# EAGLE design D5S (EAGLE 6.2)

## Sheet 1 of 2
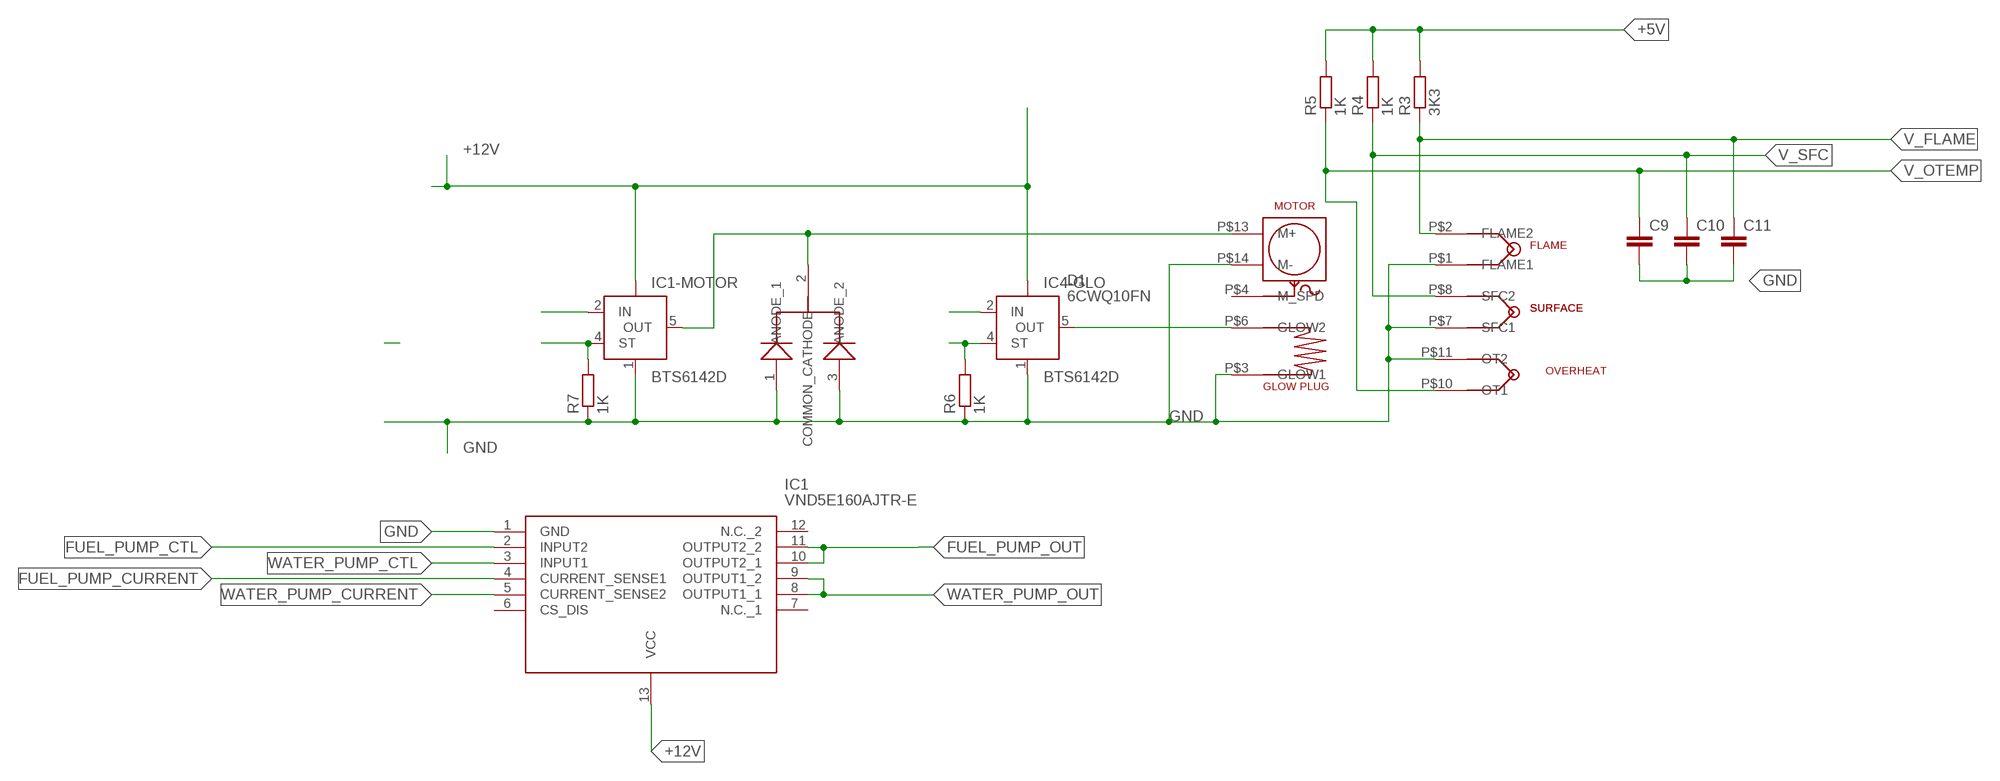
[diagram p0: schematic, sheet 1]

### Parts
C9  C-EUC0603  [C0603]
C10  C-EUC0603  [C0603]
C11  C-EUC0603  [C0603]
D1  6CWQ10FN  [6CWQ10FN]
IC1  VND5E160AJTR-E  [SOP80P600X162-13N]
IC1-MOTOR  BTS6142D  BTS428L2  [TO252-5-11]
IC4-GLO  BTS6142D  BTS428L2  [TO252-5-11]
R3  3K3  R-EU_R0603  [R0603]
R4  1K  R-EU_R0603  [R0603]
R5  1K  R-EU_R0603  [R0603]
R6  1K  R-EU_R0603  [R0603]
R7  1K  R-EU_R0603  [R0603]
U$1  D5S  [PCB]

### Nets
+5V: R3.2 R4.2 R5.2 ; also sheet 2
+12V [SPACED]: IC1-MOTOR.TAB(VBB) IC1.13(VCC) IC4-GLO.TAB(VBB)
FAN_CTL: IC1-MOTOR.2(IN) ; also sheet 2
FAN_SENSE: IC1-MOTOR.4(ST) R7.2
FUEL_PUMP_CTL: IC1.2(INPUT2) ; also sheet 2
FUEL_PUMP_CURRENT: IC1.4(CURRENT_SENSE1)
FUEL_PUMP_OUT: IC1.10(OUTPUT2_1) IC1.11(OUTPUT2_2)
GLOW_CTL: IC4-GLO.2(IN) ; also sheet 2
GLOW_SENSE: IC4-GLO.4(ST) R6.2
GND [SPACED]: C9.2 C10.2 C11.2 D1.1(ANODE_1) D1.3(ANODE_2) IC1-MOTOR.1(GND) IC1.1(GND) IC4-GLO.1(GND) R6.1 R7.1 U$1.P$1(FLAME1) U$1.P$3(GLOW1) U$1.P$7(SFC1) U$1.P$11(OT2) U$1.P$14(M-) ; also sheet 2
N$6: IC4-GLO.5(OUT) U$1.P$6(GLOW2)
N$7 [SPACED]: D1.2(COMMON_CATHODE) IC1-MOTOR.5(OUT) U$1.P$13(M+)
V_FLAME: C11.1 R3.1 U$1.P$2(FLAME2) ; also sheet 2
V_OTEMP: C9.1 R5.1 U$1.P$10(OT1) ; also sheet 2
V_SFC: C10.1 R4.1 U$1.P$8(SFC2) ; also sheet 2
WATER_PUMP_CTL: IC1.3(INPUT1) ; also sheet 2
WATER_PUMP_CURRENT: IC1.5(CURRENT_SENSE2)
WATER_PUMP_OUT: IC1.8(OUTPUT1_1) IC1.9(OUTPUT1_2)
Unconnected: IC1.6(CS_DIS) IC1.7(N.C._1) IC1.12(N.C._2) U$1.P$4(M_SPD)

## Sheet 2 of 2
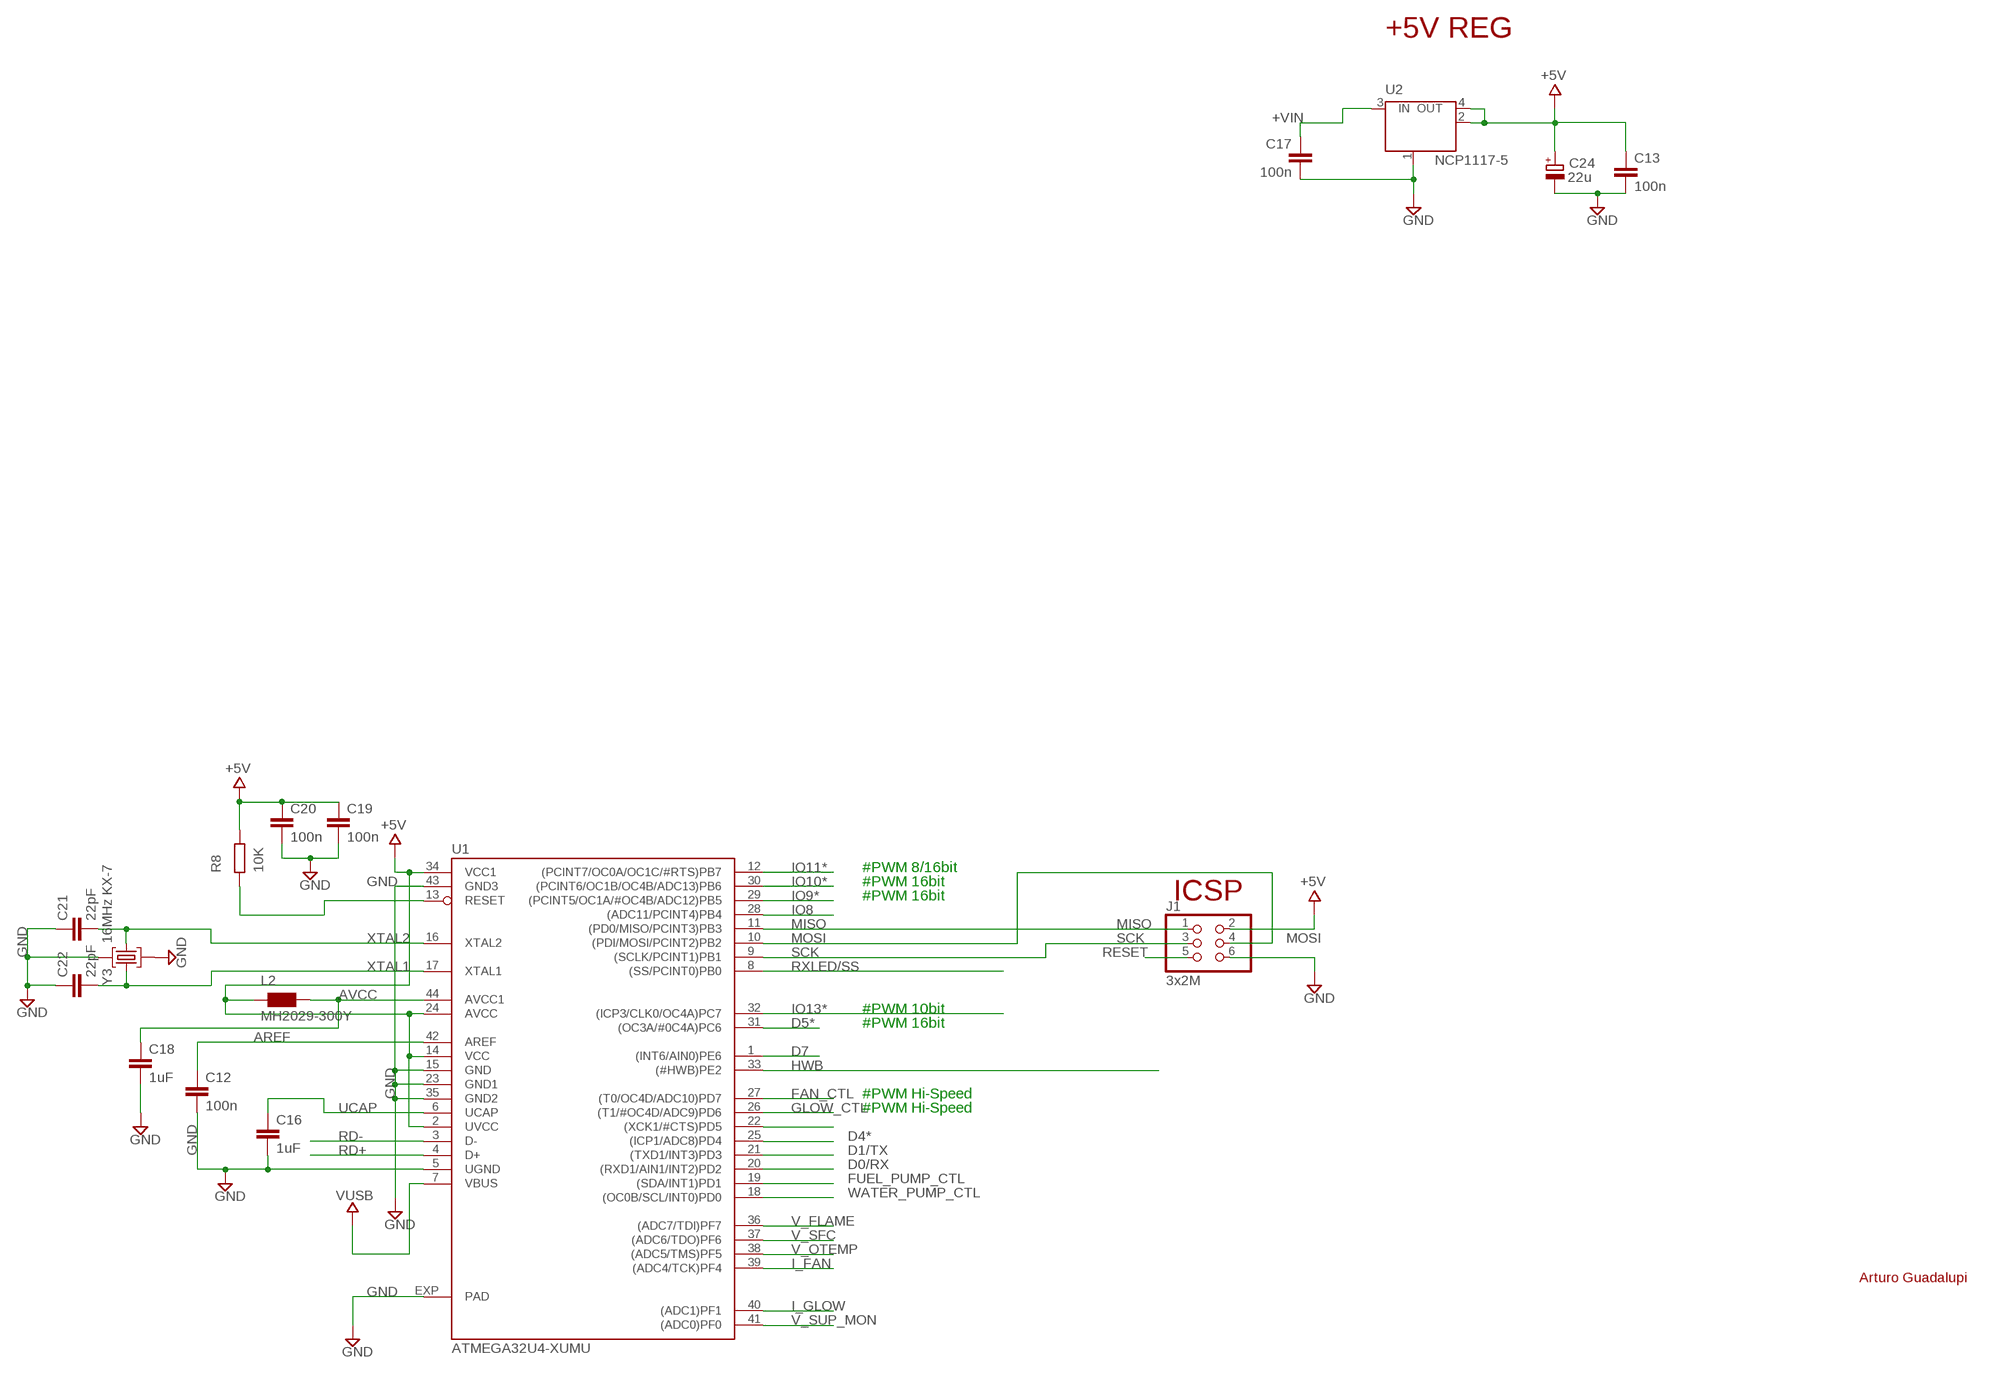
[diagram p1: schematic, sheet 2]

### Parts
C12  100n  C-EUC0402  [C0402]
C13  100n  C-EUC0402  [C0402]
C16  1uF  C-EUC0402  [C0402]
C17  100n  C-EUC0402  [C0402]
C18  1uF  C-EUC0402  [C0402]
C19  100n  C-EUC0402  [C0402]
C20  100n  C-EUC0402  [C0402]
C21  22pF  C-EUC0402  [C0402]
C22  22pF  C-EUC0402  [C0402]
C24  22u  CPOL-EUSMCB  [SMC_B]
J1  3x2M  PINHD-2X3  [2X03]
L2  MH2029-300Y  WE-CBF_0805  [0805]
R8  10K  R-EU_R0402  [R0402]
U1  ATMEGA32U4-XUMU  [QFN44ML7X7]
U2  NCP1117-5  LINEAR_MC33269ST  [SOT223]
Y3  16MHz KX-7  CRYSTAL-3.2-2.5  [CRYSTAL-3.2-2.5]

### Nets
+5V: C13.1 C19.1 C20.1 C24.+ J1.2 L2.1 R8.1 U1.2(UVCC) U1.14(VCC) U1.24(AVCC) U1.34(VCC1) U2.2(OUT) U2.4(OUT) ; also sheet 1
+VIN: C17.1 U2.3(IN)
AREF: C12.1 U1.42(AREF)
AVCC: C18.1 L2.2 U1.44(AVCC1)
D0/RX: U1.20((RXD1/AIN1/INT2)PD2)
D1/TX: U1.21((TXD1/INT3)PD3)
D4*: U1.25((ICP1/ADC8)PD4)
D5*: U1.31((OC3A/#0C4A)PC6)
D7: U1.1((INT6/AIN0)PE6)
FAN_CTL: U1.27((T0/OC4D/ADC10)PD7) ; also sheet 1
FUEL_PUMP_CTL: U1.19((SDA/INT1)PD1) ; also sheet 1
GLOW_CTL: U1.26((T1/#OC4D/ADC9)PD6) ; also sheet 1
GND [SPACED]: C12.2 C13.2 C16.2 C17.2 C18.2 C19.2 C20.2 C21.1 C22.1 C24.- J1.6 U1.5(UGND) U1.15(GND) U1.23(GND1) U1.35(GND2) U1.43(GND3) U1.EXP(PAD) U2.1(GND/ADJ) Y3.2(GND) Y3.4(GND) ; also sheet 1
HWB: U1.33((#HWB)PE2)
I_FAN: U1.39((ADC4/TCK)PF4)
I_GLOW: U1.40((ADC1)PF1)
IO8: U1.28((ADC11/PCINT4)PB4)
IO9*: U1.29((PCINT5/OC1A/#OC4B/ADC12)PB5)
IO10*: U1.30((PCINT6/OC1B/OC4B/ADC13)PB6)
IO11*: U1.12((PCINT7/OC0A/OC1C/#RTS)PB7)
IO13*: U1.32((ICP3/CLK0/OC4A)PC7)
MISO: J1.1 U1.11((PD0/MISO/PCINT3)PB3)
MOSI: J1.4 U1.10((PDI/MOSI/PCINT2)PB2)
RD+: U1.4(D+)
RD-: U1.3(D-)
RESET: J1.5 R8.2 U1.13(RESET)
RXLED/SS: U1.8((SS/PCINT0)PB0)
SCK: J1.3 U1.9((SCLK/PCINT1)PB1)
TXLED: U1.22((XCK1/#CTS)PD5)
UCAP: C16.1 U1.6(UCAP)
V_FLAME: U1.36((ADC7/TDI)PF7) ; also sheet 1
V_OTEMP: U1.38((ADC5/TMS)PF5) ; also sheet 1
V_SFC: U1.37((ADC6/TDO)PF6) ; also sheet 1
V_SUP_MON: U1.41((ADC0)PF0)
VUSB: U1.7(VBUS)
WATER_PUMP_CTL: U1.18((OC0B/SCL/INT0)PD0) ; also sheet 1
XTAL1: C22.2 U1.17(XTAL1) Y3.3(C2)
XTAL2: C21.2 U1.16(XTAL2) Y3.1(C1)

### Notes on the sheet
- +5V REG
- #PWM 8/16bit
- #PWM 16bit
- #PWM 16bit | ICSP
- #PWM 10bit
- #PWM 16bit
- #PWM Hi-Speed
- #PWM Hi-Speed
- Arturo Guadalupi

## Library data of the parts
C9-C11 = resistor:C-EU: CAPACITOR, European symbol
C12 C13 C16-C22 = gen_comp:C-EU: CAPACITOR, European symbol
C24 = rcl:CPOL-EU: POLARIZED CAPACITOR, European symbol
D1 = 6CWQ10FN:6CWQ10FN: DIODE ARRAY SCHOTTKY 100V DPAK Source: Datasheet <https://www.vishay.com/docs/93318/6cwq10fn.pdf>; DESCRIPTION: DIODE ARRAY SCHOTTKY 100V DPAK; HEIGHT: 2.39mm; MANUFACTURER_NAME: Vishay; MANUFACTURER_PART_NUMBER: 6CWQ10FN; MOUSER_PART_NUMBER: 844-6CWQ10FN; MOUSER_PRICE-STOCK: https://www.mouser.com/Search/Refine.aspx?Keyword=844-6CWQ10FN
IC1 = VND5E160AJTR-E:VND5E160AJTR-E: Double channel high side driver with analog current sense for automotive applications Source: Datasheet <https://www.st.com/resource/en/datasheet/vnd5e160aj-e.pdf>; ARROW_PART_NUMBER: VND5E160AJTR-E; ARROW_PRICE-STOCK: https://www.arrow.com/en/products/vnd5e160ajtr-e/stmicroelectronics; DESCRIPTION: Double channel high side driver with analog current sense for automotive applications; HEIGHT: 1.62mm; MANUFACTURER_NAME: STMicroelectronics; MANUFACTURER_PART_NUMBER: VND5E160AJTR-E; MOUSER_PART_NUMBER: 511-VND5E160AJTR-E; MOUSER_PRICE-STOCK: https://www.mouser.co.uk/ProductDetail/STMicroelectronics/VND5E160AJTR-E?qs=%252BB84zevwoRBQ6E2cyA0a1g%3D%3D
IC1-MOTOR IC4-GLO = micro-siemens:BTS428L2: Smart High-Side Power Switch One Channel: 60mOhm Status Feedback Source: Source: www.infineon.com .. BTS428L2_20030912.pdf; OC_FARNELL: unknown; OC_NEWARK: unknown
J1 = gen_comp:PINHD-2X3: PIN HEADER
L2 = wuerth-elektronik:WE-CBF: SMD EMI Suppression Ferrite Beads - excellent anti-EMI properties - low DCR - impedances till 3000 ohms - rated current up to 6 A
R3-R7 = resistor:R-EU_: RESISTOR, European symbol
R8 = gen_comp:R-EU_: RESISTOR, European symbol
U1 = gen_comp:ATMEGA32U4-XU
U2 = gen_comp:LINEAR_MC33269ST*: Adjustable Output Low Dropout Voltage Regulator 800 mA Source: http://www.onsemi.com/pub/Collateral/MC33269-D.PDF
U$1 = Ebersacher:D5S
Y3 = gen_comp:CRYSTAL-3.2-2.5

## Net classes
0 default: width 0.254 mm, drill 0.5 mm, clearance 0.203 mm
1 SPACED: clearance 1 mm

## Board
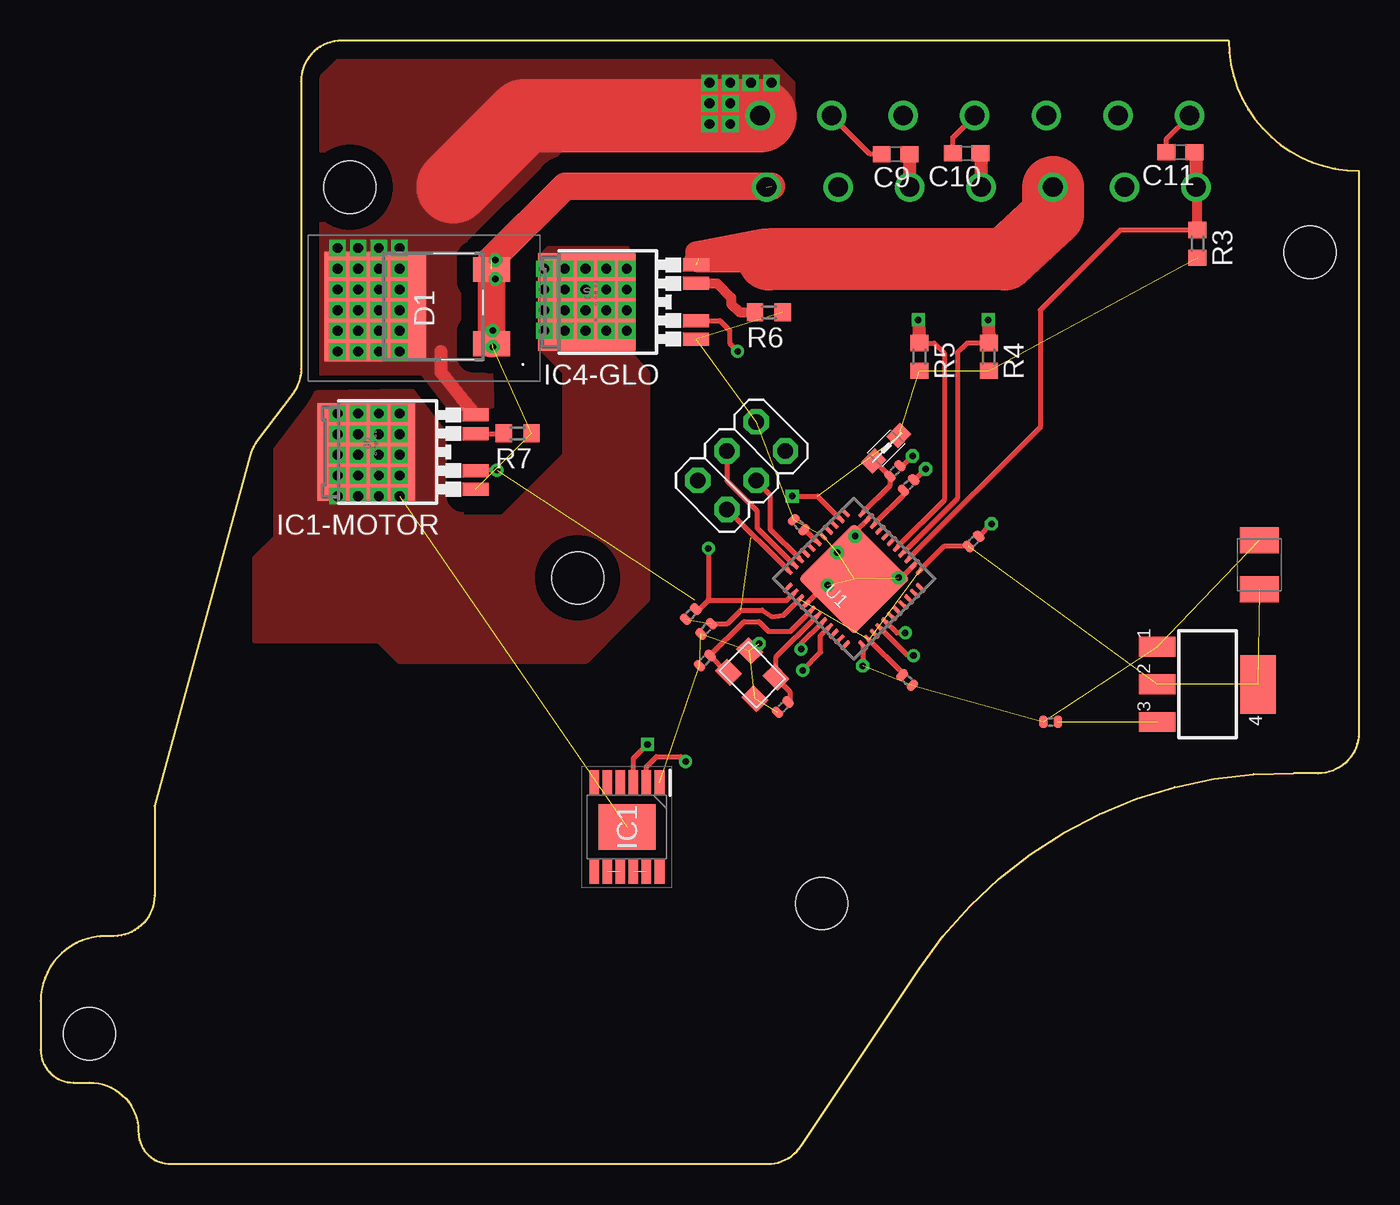
[diagram p2: board, top side]
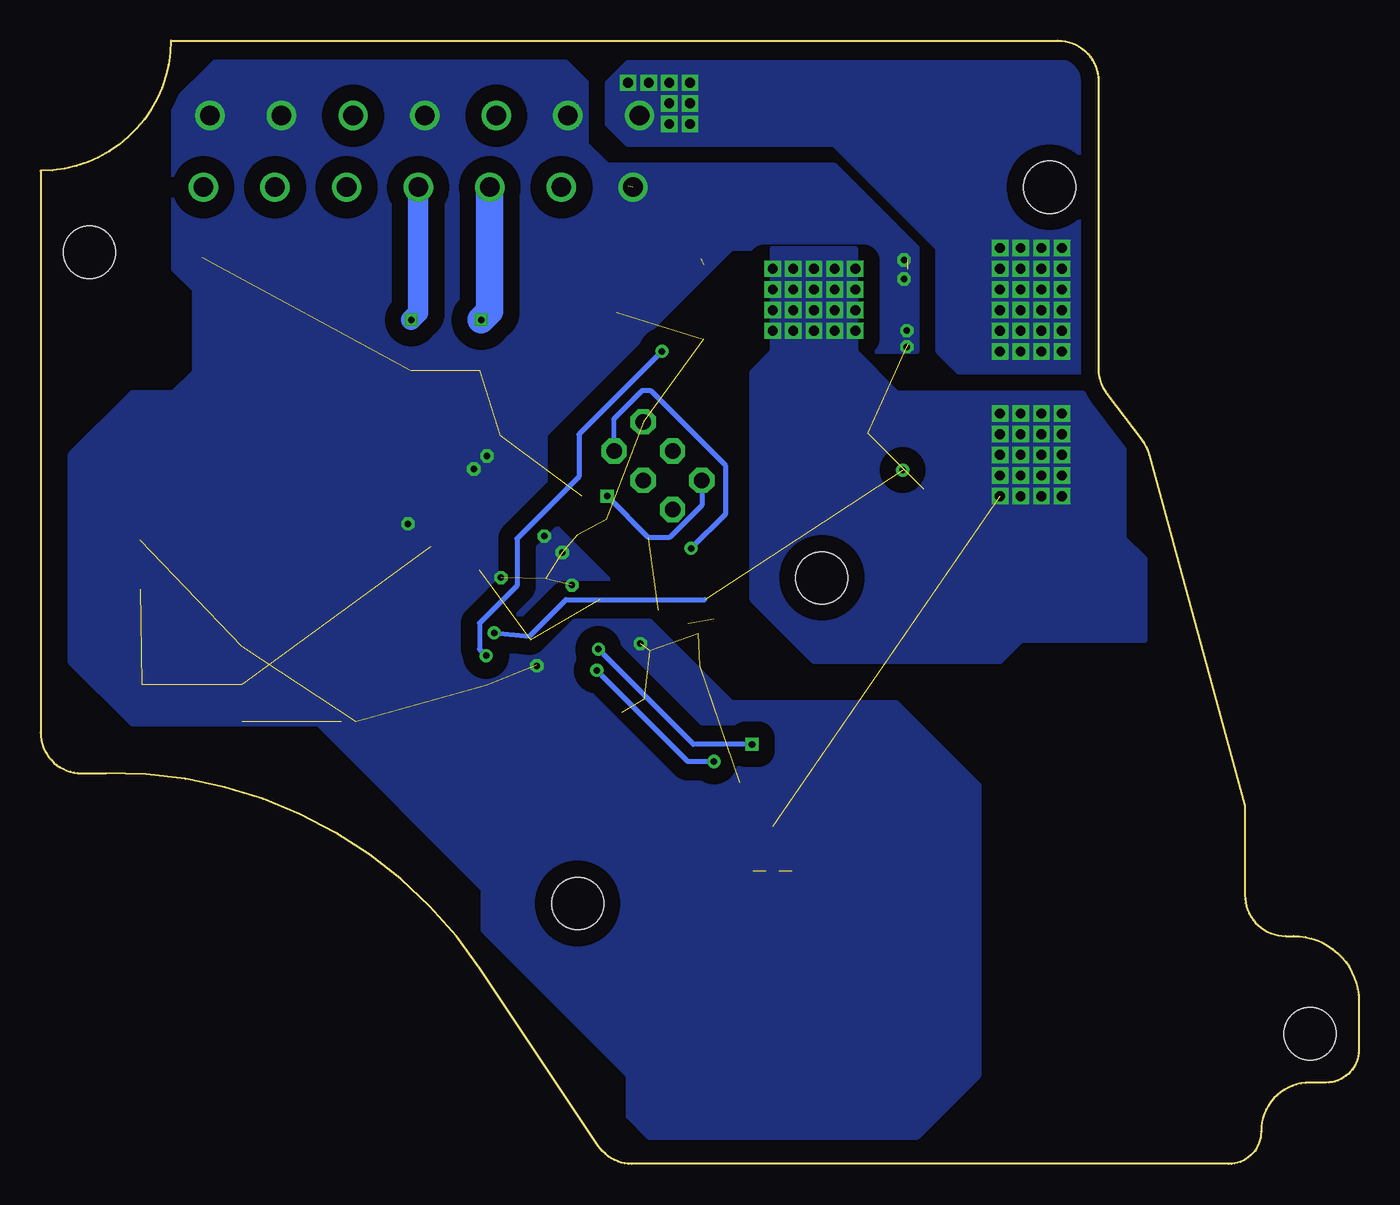
[diagram p3: board, bottom side, seen from below]

Size 81 x 69 mm. Coordinates in mm from the lower left corner, seen from the top.
Copper layers ((1*2)+(15*16)): Top 0.035mm / dielectric 1.5mm / Route2 0.035mm / dielectric 0.15mm / Route15 0.035mm / dielectric 0.2mm / Bottom 0.035mm
Design rules: minimum track width 10mil, minimum drill 24mil, track to track 8mil, track to pad 8mil, pad to pad 8mil, via to via 8mil, smd to smd 8mil, copper to edge 40mil, drill to drill 8mil, minimum pad ring 10mil, minimum via ring 8mil, stop-mask expansion 4mil, vias tented up to drill 0mil, thermal gap 10mil

### Footprints (pad centres in the part's own frame; a part is rotated, then mirrored left to right if it is on the bottom)
C0603 = smd 1.1 x 1: 1 -0.85,0; 2 0.85,0
C0402 = smd 0.508 x 0.762: 1 -0.445,0; 2 0.445,0
SMC_B = smd 1.6 x 2.4: + -1.5,0; - 1.5,0
6CWQ10FN = smd 1.524 x 2.28: 1 -2.28,-3.573; 3 2.28,-3.573 | smd 6.74 x 6.23: 2 0,3.572
SOP80P600X162-13N = smd 1.525 x 0.6: 1 -2.712,2; 2 -2.712,1.2; 3 -2.712,0.4; 4 -2.712,-0.4; 5 -2.712,-1.2; 6 -2.712,-2; 7 2.712,-2; 8 2.712,-1.2; 9 2.712,-0.4; 10 2.712,0.4; 11 2.712,1.2; 12 2.712,2 | smd 2.8 x 3.5: 13 0,0
TO252-5-11 = smd 0.8 x 1.6: 1 -2.28,-5.41; 2 -1.14,-5.41; 4 1.14,-5.41; 5 2.28,-5.41 | smd 6 x 6: TAB 0,1.3
2X03 = drill 0.95 pad 1.55 octagon: 1 -2.54,-1.27; 2 -2.54,1.27; 3 0,-1.27; 4 0,1.27; 5 2.54,-1.27; 6 2.54,1.27
0805 = smd 1.2 x 1: 1 -1.1,0; 2 1.1,0
R0603 = smd 1 x 1.1: 1 -0.85,0; 2 0.85,0
R0402 = smd 0.508 x 0.762: 1 -0.445,0; 2 0.445,0
QFN44ML7X7 = smd 0.75 x 0.275: 1 -3.275,2.5; 2 -3.275,2; 3 -3.275,1.5; 4 -3.275,1; 5 -3.275,0.5; 6 -3.275,0; 7 -3.275,-0.5; 8 -3.275,-1; 9 -3.275,-1.5; 10 -3.275,-2; 11 -3.275,-2.5; 23 3.275,-2.5; 24 3.275,-2; 25 3.275,-1.5; 26 3.275,-1; 27 3.275,-0.5; 28 3.275,0; 29 3.275,0.5; 30 3.275,1; 31 3.275,1.5; 32 3.275,2; 33 3.275,2.5 | smd 0.275 x 0.75: 12 -2.5,-3.275; 13 -2,-3.275; 14 -1.5,-3.275; 15 -1,-3.275; 16 -0.5,-3.275; 17 0,-3.275; 18 0.5,-3.275; 19 1,-3.275; 20 1.5,-3.275; 21 2,-3.275; 22 2.5,-3.275; 34 2.5,3.275; 35 2,3.275; 36 1.5,3.275; 37 1,3.275; 38 0.5,3.275; 39 0,3.275; 40 -0.5,3.275; 41 -1,3.275; 42 -1.5,3.275; 43 -2,3.275; 44 -2.5,3.275 | smd 4.826 x 4.826: EXP 0,0
SOT223 = smd 1.219 x 2.235: 1 -2.311,-3.099; 2 0,-3.099; 3 2.311,-3.099 | smd 3.6 x 2.2: 4 0,3.099
PCB = drill 1.2: P$1 67.6,56.4; P$2 68,52; P$3 63.2,56.4; P$4 63.6,52; P$5 58.8,56.4; P$6 59.2,52; P$7 54.4,56.4; P$8 54.8,52; P$9 50,56.4; P$10 50.4,52; P$11 45.6,56.4; P$12 46,52; P$13 41.2,56.4; P$14 41.6,52 | hole 3.2: 75,48; 45,8; 30,28; 16,52; 0,0
CRYSTAL-3.2-2.5 = smd 1.3 x 1.05: 1 -1.15,-0.925; 2 1.15,-0.925; 3 1.15,0.925; 4 -1.15,0.925

### Placement (x,y rotation side)
C9  52.53,62.03 180 top
C10  56.9,62.08 180 top
C11  70.03,62.15 180 top
C12  53.33,41.71 45 top
C13  40.9,32.87 225 top
C16  46.59,39.27 135 top
C17  62.06,27.15 180 top
C18  52.49,42.57 45 top
C19  53.26,29.72 315 top
C20  57.32,38.25 45 top
C21  40.81,30.92 45 top
C22  45.6,28.06 45 top
C24  74.89,36.8 90 top
D1  24.13,52.67 90 top
IC1  36.02,20.7 270 top
IC1-MOTOR  21.32,43.73 90 top
IC4-GLO  34.85,52.95 90 top
J1  43.07,42.89 45 top
L2  51.96,43.97 225 top
R3  71.08,56.52 270 top
R4  58.26,49.58 270 top
R5  54,49.58 270 top
R6  44.75,52.31 180 top
R7  29.31,44.88 180 top
R8  39.94,33.77 45 top
U1  49.99,35.94 315 top
U2  71.71,29.46 270 top
U$1  3,8 0 top
Y3  43.73,30.05 315 top

### Tracks (layer width: path | path; a pad name or v marks a point on that pad's centre or on a via)
+5V  (via drill 0.4)  (11 unrouted)
  Top 0.305: v46.18,41.02 47.74,41.02 U1.2 | C20.1 55.52,37.93 U1.34 | C19.1 52.94,30.16 U1.24 | C13.1 42.2,33.19 43.03,34.02 44.33,34.02 44.93,33.62 45.65,33.72 U1.14
  Bottom 0.305: J1.2 40.38,40.47 42.37,38.48 43.64,38.48 v46.18,41.02
+12V  (via drill 0.6)  (1 unrouted)
  other vias: 18.24,46.1 18.24,44.83 18.24,43.56 18.24,42.29 18.24,41.02 19.51,46.1 20.78,46.1 22.05,46.1 19.51,44.83 19.51,43.56 19.51,42.29 19.51,41.02 20.78,44.83 20.78,43.56 20.78,42.29 20.78,41.02 22.05,44.83 22.05,43.56 22.05,42.29 22.05,41.02 30.94,54.99 32.21,54.99 33.48,54.99 34.75,54.99 36.02,54.99 30.94,53.72 30.94,52.45 30.94,51.18 32.21,53.72 32.21,52.45 32.21,51.18 33.48,53.72 33.48,52.45 33.48,51.18 34.75,53.72 34.75,52.45 34.75,51.18 36.02,53.72 36.02,52.45 36.02,51.18
  pour Top (no thermals): 16.97,47.37 14.43,44.83 14.43,38.48 13.16,37.21 13.16,32.13 24.59,32.13 25.86,33.4 25.86,43.56 22.85,47.47
  pour Top (no thermals): 30.94,56.26 36.02,56.26 36.02,49.91 37.29,48.64 37.29,34.67 33.48,30.86 22.05,30.86 19.51,33.4 19.51,37.21 22.05,39.75 28.4,39.75 32.21,43.56 32.21,48.64 30.94,49.91
  pour Bottom (no thermals): 16.97,47.37 14.43,44.83 14.43,38.48 13.16,37.21 13.16,32.13 20.78,32.13 22.05,30.86 33.48,30.86 37.29,34.67 37.29,48.64 36.02,49.91 36.02,56.26 30.94,56.26 30.94,49.91 28.4,47.37
+VIN  (1 unrouted)
AREF
  Top 0.305: C12.1 53.01,41.09 U1.42
AVCC
  Top 0.305: U1.44 52.17,41.66 C18.1 51.24,43.19 L2.2
FAN_CTL  (via drill 0.4)  (1 unrouted)
  Top 0.305: v28.03,42.62 26.76,42.62 IC1-MOTOR.2 | v53.13,32.62 52.6,32.62 U1.27
  Bottom 0.305: v53.13,32.62 50.97,32.42 48.72,34.67 40.18,34.67
FAN_SENSE
  Top 0.305: IC1-MOTOR.4 R7.2
FUEL_PUMP_CTL  (via drill 0.4)
  Top 0.305: IC1.2 37.22,24.41 37.83,25.02 39.33,25.02 v39.63,24.72 | v46.83,30.32 47.93,31.42 47.93,32.47 U1.19
  Bottom 0.305: v39.63,24.72 41.23,24.72 v46.83,30.32
FUEL_PUMP_OUT  (1 unrouted)
GLOW_CTL  (via drill 0.4)
  Top 0.305: IC4-GLO.2 41.74,51.81 42.33,51.22 42.33,50.42 v42.83,49.92 | v53.63,31.22 53.3,31.22 U1.26
  Bottom 0.305: v42.83,49.92 47.93,44.82 47.93,42.22 51.73,38.42 51.73,35.52 54.03,33.22 54.03,31.62 v53.63,31.22
GLOW_SENSE
  Top 0.61: IC4-GLO.4 41.56,54.09 42.43,53.22 42.43,52.82 42.93,52.32 R6.2
GND  (via drill 0.4)  (23 unrouted)
  Top 0.305: C9.2 50.97,62.03 U$1.P$11 | C10.2 56.05,63.05 U$1.P$7 | C11.2 69.18,62.98 U$1.P$1 | v50.05,38.56 50.05,38.83 U1.43 | v52.71,36.02 52.9,36.02 U1.35 | v48.35,35.56 48.2,35.56 U1.15 | U1.23 50.54,30.63 v50.51,30.6 | C20.2 57.67,38.56 v58.43,39.32 | C12.2 53.71,42.02 v54.38,42.69 | C18.2 52.97,42.89 v53.58,43.49
  Top 1.676: D1.1 27.7,55.56 32.21,60.07 44.91,60.07
  other vias: 48.95,37.56 44.15,31.96 27.95,54.36 27.95,55.53 27.78,51.19 27.78,50.19
  pour Bottom (no thermals): 48.72,67.69 70.31,67.69 72.85,65.15 72.85,54.99 71.58,53.72 71.58,48.64 72.85,47.37 75.39,47.37 79.2,43.56 79.2,30.86 75.39,27.05 63.96,27.05 53.8,16.89 53.8,14.35 44.91,5.46 44.91,2.92 43.64,1.65 27.13,1.65 23.32,5.46 23.32,23.24 28.4,28.32 38.56,28.32 49.99,39.75 49.99,44.83 38.56,56.26 29.67,56.26 29.67,49.91 27.13,49.91 27.13,56.26 32.21,61.34 46.18,61.34 47.45,62.61 47.45,66.42
MISO
  Top 0.305: J1.1 42.2,40.2 U1.11
MOSI
  Top 0.305: J1.4 42.17,41.98 44.03,40.12 44.03,39.07 U1.10
N$4
  Top 1.27: 41.03,55.82 40.23,56.02 44.43,56.82 44.93,56.32
N$6  (1 unrouted)
  Top 1.676: 44.74,55.56 43.64,55.74 43.02,55.62 40.42,55.62 | 41.92,55.72 40.42,55.62 | 40.42,55.62 47.13,55.72
  Top 3.81: U$1.P$6 62.2,58.31 59.25,55.56 44.74,55.56
N$7  (via drill 0.6)
  Top 0.813: IC1-MOTOR.5 25.82,47.11 24.59,48.64 24.59,49.91
  Top 4.5: U$1.P$13 29.71,64.4 25.33,60.02
  other vias: 18.24,56.26 18.24,54.99 18.24,53.72 18.24,52.45 18.24,51.18 18.24,49.91 19.51,49.91 22.05,49.91 20.78,49.91 19.51,51.18 19.51,52.45 19.51,53.72 19.51,54.99 20.78,53.72 20.78,52.45 20.78,51.18 20.78,54.99 19.51,56.26 20.78,56.26 22.05,56.26 22.05,54.99 22.05,53.72 22.05,52.45 22.05,51.18 43.64,66.42 42.37,66.42 41.1,66.42 41.1,65.15 41.1,63.88 42.37,65.15 42.37,63.88 44.91,66.42
  pour Top (no thermals): 23.49,48.64 16.97,48.64 16.97,66.42 18.24,67.69 44.91,67.69 46.18,66.42 46.18,63.88 44.91,62.61 32.21,62.61 25.86,56.26 25.86,51.18 25.8,49.78 27.63,48.54 27.7,46.37 25.26,46.37
  pour Bottom (no thermals): 16.97,67.69 16.97,48.64 24.59,48.64 25.86,49.91 25.86,56.26 32.21,62.61 44.91,62.61 46.18,63.88 46.18,66.42 44.91,67.69
RESET  (via drill 0.4)
  Top 0.305: R8.2 40.5,34.09 41.03,34.62 41.1,34.62 | 41.1,34.62 45.84,34.62 U1.13 | v41.03,37.82 41.03,34.69 41.1,34.62
  Bottom 0.305: J1.5 45.76,45.79 44.03,47.52 43.53,47.52 38.93,42.92 38.93,39.92 v41.03,37.82
SCK
  Top 0.305: J1.3 44.83,41.12 44.83,38.98 U1.9
UCAP
  Top 0.305: C16.1 46.98,38.95 U1.6
V_FLAME
  Top 0.305: R3.1 66.34,57.37 61.42,52.45 61.42,45.25 U1.36
  Top 0.61: R3.1 71.08,59.92 U$1.P$2
  Top 0.813: U$1.P$2 71,62.03 C11.1
V_OTEMP  (via drill 0.4)
  Top 0.305: R5.1 54.92,50.43 55.53,49.82 55.53,40.77 U1.38
  Top 0.813: v53.93,51.85 53.93,51.77 R5.1 | U$1.P$10 53.4,62.01 C9.1
  Bottom 1.676: U$1.P$10 53.4,52.38 v53.93,51.85
V_SFC  (via drill 0.4)
  Top 0.305: R4.1 56.94,50.43 56.33,49.82 56.33,40.87 U1.37
  Top 0.813: v58.23,51.85 58.23,51.73 R4.1 | U$1.P$8 57.8,62.03 C10.1
  Bottom 1.27: U$1.P$8 57.8,52.28 v58.23,51.85
WATER_PUMP_CTL  (via drill 0.4)
  Top 0.305: IC1.3 36.42,24.91 v37.29,25.78 | v46.73,31.62 46.73,31.97 U1.18
  Bottom 0.305: v37.29,25.78 40.89,25.78 v46.73,31.62
WATER_PUMP_OUT  (1 unrouted)
XTAL1
  Top 0.305: U1.17 45.2,31.15 Y3.3 45.2,29.85 46.03,29.02 46.03,28.49 C22.2
XTAL2
  Top 0.305: Y3.1 42.15,30.21 C21.2 41.14,31.23 43.23,33.32 44.13,33.32 44.73,32.72 46.06,32.72 U1.16